# EAGLE design usbSimRadio_v1_0 (EAGLE 5.06)

## Sheet 1 of 2
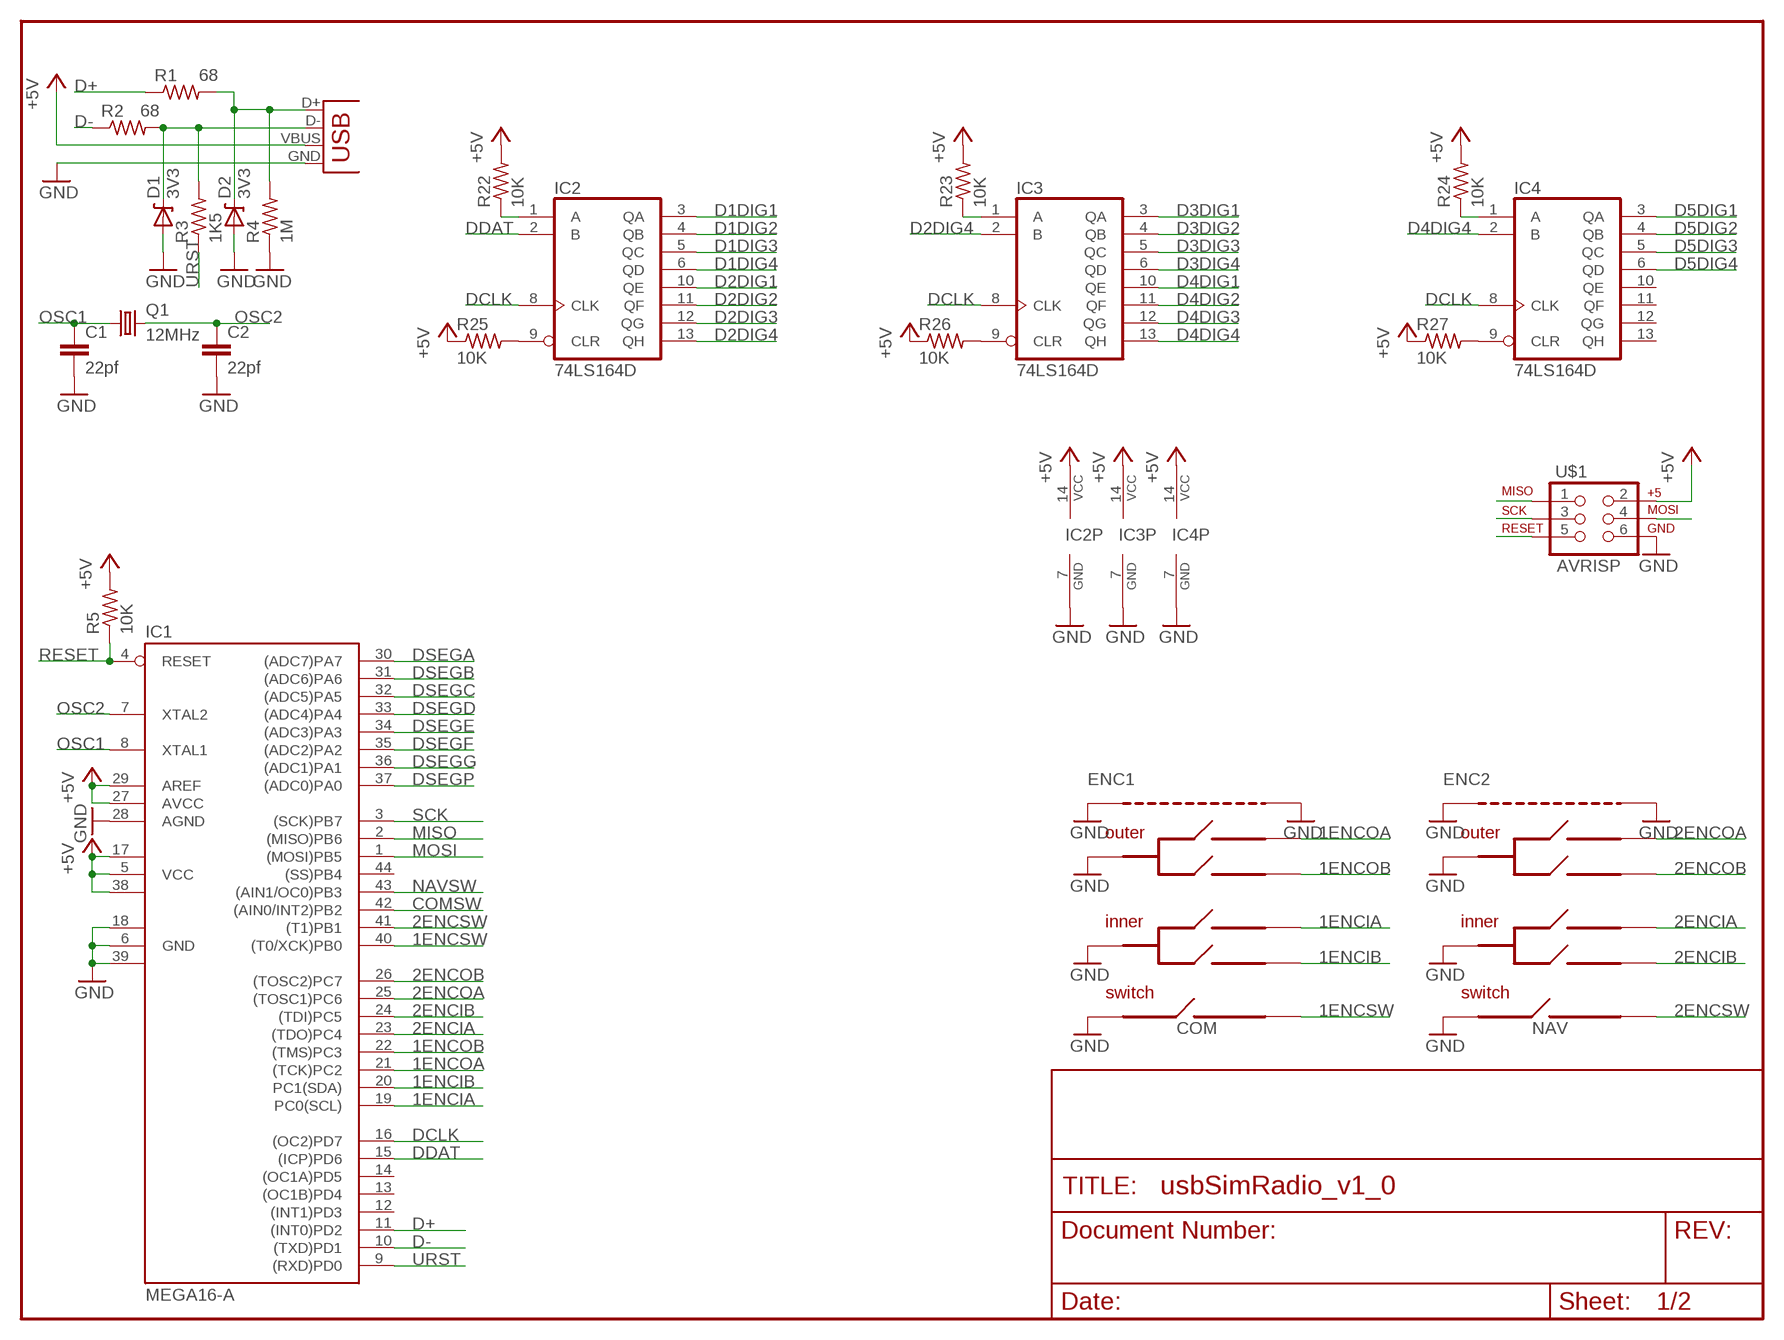
[diagram p0: schematic, sheet 1]

### Parts
C1  22pf  C2.5/2  [C2.5-2]
C2  22pf  C2.5/2  [C2.5-2]
D1  3V3  DIODE-ZENERPTH  [DIODE-ZENER]
D2  3V3  DIODE-ZENERPTH  [DIODE-ZENER]
ENC1  COM  EC11EBB24C03  [EC11EBB24C03]
ENC2  NAV  EC11EBB24C03  [EC11EBB24C03]
IC1  MEGA16-A  [TQFP44]
IC2  74LS164D  [SO14]
IC3  74LS164D  [SO14]
IC4  74LS164D  [SO14]
Q1  12MHz  CRYSTALHC49UP  [HC49UP]
R1  68  R-US_0204/7  [0204/7]
R2  68  R-US_0204/7  [0204/7]
R3  1K5  R-US_0204/7  [0204/7]
R4  1M  R-US_0204/7  [0204/7]
R5  10K  R-US_0204/7  [0204/7]
R22  10K  R-US_0204/7  [0204/7]
R23  10K  R-US_0204/7  [0204/7]
R24  10K  R-US_0204/7  [0204/7]
R25  10K  R-US_0204/7  [0204/7]
R26  10K  R-US_0204/7  [0204/7]
R27  10K  R-US_0204/7  [0204/7]
U$1  AVRISP  AVR_SPI_PRG_6PTH  [2X3]
X1  USBPTH-VERTICAL  [USB-B-PTH-VERTICAL]

### Nets
1ENCIA: ENC1.A IC1.19(PC0(SCL))
1ENCIB: ENC1.B IC1.20(PC1(SDA))
1ENCOA: ENC1.A' IC1.21((TCK)PC2)
1ENCOB: ENC1.B' IC1.22((TMS)PC3)
1ENCSW: ENC1.D IC1.40((T0/XCK)PB0)
2ENCIA: ENC2.A IC1.23((TDO)PC4)
2ENCIB: ENC2.B IC1.24((TDI)PC5)
2ENCOA: ENC2.A' IC1.25((TOSC1)PC6)
2ENCOB: ENC2.B' IC1.26((TOSC2)PC7)
2ENCSW: ENC2.D IC1.41((T1)PB1)
+5V: IC1.5(VCC) IC1.17(VCC1) IC1.27(AVCC) IC1.29(AREF) IC1.38(VCC2) IC2.14(VCC) IC3.14(VCC) IC4.14(VCC) R5.2 R22.2 R23.2 R24.2 R25.1 R26.1 R27.1 U$1.2 X1.VBUS
COMSW: IC1.42((AIN0/INT2)PB2) ; also sheet 2
D1DIG1: IC2.3(QA) ; also sheet 2
D1DIG2: IC2.4(QB) ; also sheet 2
D1DIG3: IC2.5(QC) ; also sheet 2
D1DIG4: IC2.6(QD) ; also sheet 2
D2DIG1: IC2.10(QE) ; also sheet 2
D2DIG2: IC2.11(QF) ; also sheet 2
D2DIG3: IC2.12(QG) ; also sheet 2
D2DIG4: IC2.13(QH) IC3.2(B) ; also sheet 2
D3DIG1: IC3.3(QA) ; also sheet 2
D3DIG2: IC3.4(QB) ; also sheet 2
D3DIG3: IC3.5(QC) ; also sheet 2
D3DIG4: IC3.6(QD) ; also sheet 2
D4DIG1: IC3.10(QE) ; also sheet 2
D4DIG2: IC3.11(QF) ; also sheet 2
D4DIG3: IC3.12(QG) ; also sheet 2
D4DIG4: IC3.13(QH) IC4.2(B) ; also sheet 2
D5DIG1: IC4.3(QA) ; also sheet 2
D5DIG2: IC4.4(QB) ; also sheet 2
D5DIG3: IC4.5(QC) ; also sheet 2
D5DIG4: IC4.6(QD) ; also sheet 2
D+: IC1.11((INT0)PD2) R1.1
D-: IC1.10((TXD)PD1) R2.1
DCLK: IC1.16((OC2)PD7) IC2.8(CLK) IC3.8(CLK) IC4.8(CLK)
DDAT: IC1.15((ICP)PD6) IC2.2(B)
DSEGA: IC1.30((ADC7)PA7) ; also sheet 2
DSEGB: IC1.31((ADC6)PA6) ; also sheet 2
DSEGC: IC1.32((ADC5)PA5) ; also sheet 2
DSEGD: IC1.33((ADC4)PA4) ; also sheet 2
DSEGE: IC1.34((ADC3)PA3) ; also sheet 2
DSEGF: IC1.35((ADC2)PA2) ; also sheet 2
DSEGG: IC1.36((ADC1)PA1) ; also sheet 2
DSEGP: IC1.37((ADC0)PA0) ; also sheet 2
GND: C1.2 C2.2 D1.P$2(A) D2.P$2(A) ENC1.B1 ENC1.B2 ENC1.C ENC1.C' ENC1.E ENC2.B1 ENC2.B2 ENC2.C ENC2.C' ENC2.E IC1.6(GND) IC1.18(GND1) IC1.28(AGND) IC1.39(GND2) IC2.7(GND) IC3.7(GND) IC4.7(GND) R4.1 U$1.6 X1.GND ; also sheet 2
MISO: IC1.2((MISO)PB6) U$1.1
MOSI: IC1.1((MOSI)PB5) U$1.4
N$14: IC2.1(A) R22.1
N$15: IC4.1(A) R24.1
N$19: IC3.1(A) R23.1
N$22: IC2.9(CLR) R25.2
N$23: IC3.9(CLR) R26.2
N$24: IC4.9(CLR) R27.2
N$81: D2.P$1(C) R1.2 R4.2 X1.D+
N$84: D1.P$1(C) R2.2 R3.2 X1.D-
NAVSW: IC1.43((AIN1/OC0)PB3) ; also sheet 2
OSC1: C1.1 IC1.8(XTAL1) Q1.1
OSC2: C2.1 IC1.7(XTAL2) Q1.2
RESET: IC1.4(RESET) R5.1 U$1.5
SCK: IC1.3((SCK)PB7) U$1.3
URST: IC1.9((RXD)PD0) R3.1
Unconnected: IC1.12((INT1)PD3) IC1.13((OC1B)PD4) IC1.14((OC1A)PD5) IC1.44((SS)PB4) IC4.10(QE) IC4.11(QF) IC4.12(QG) IC4.13(QH)

## Sheet 2 of 2
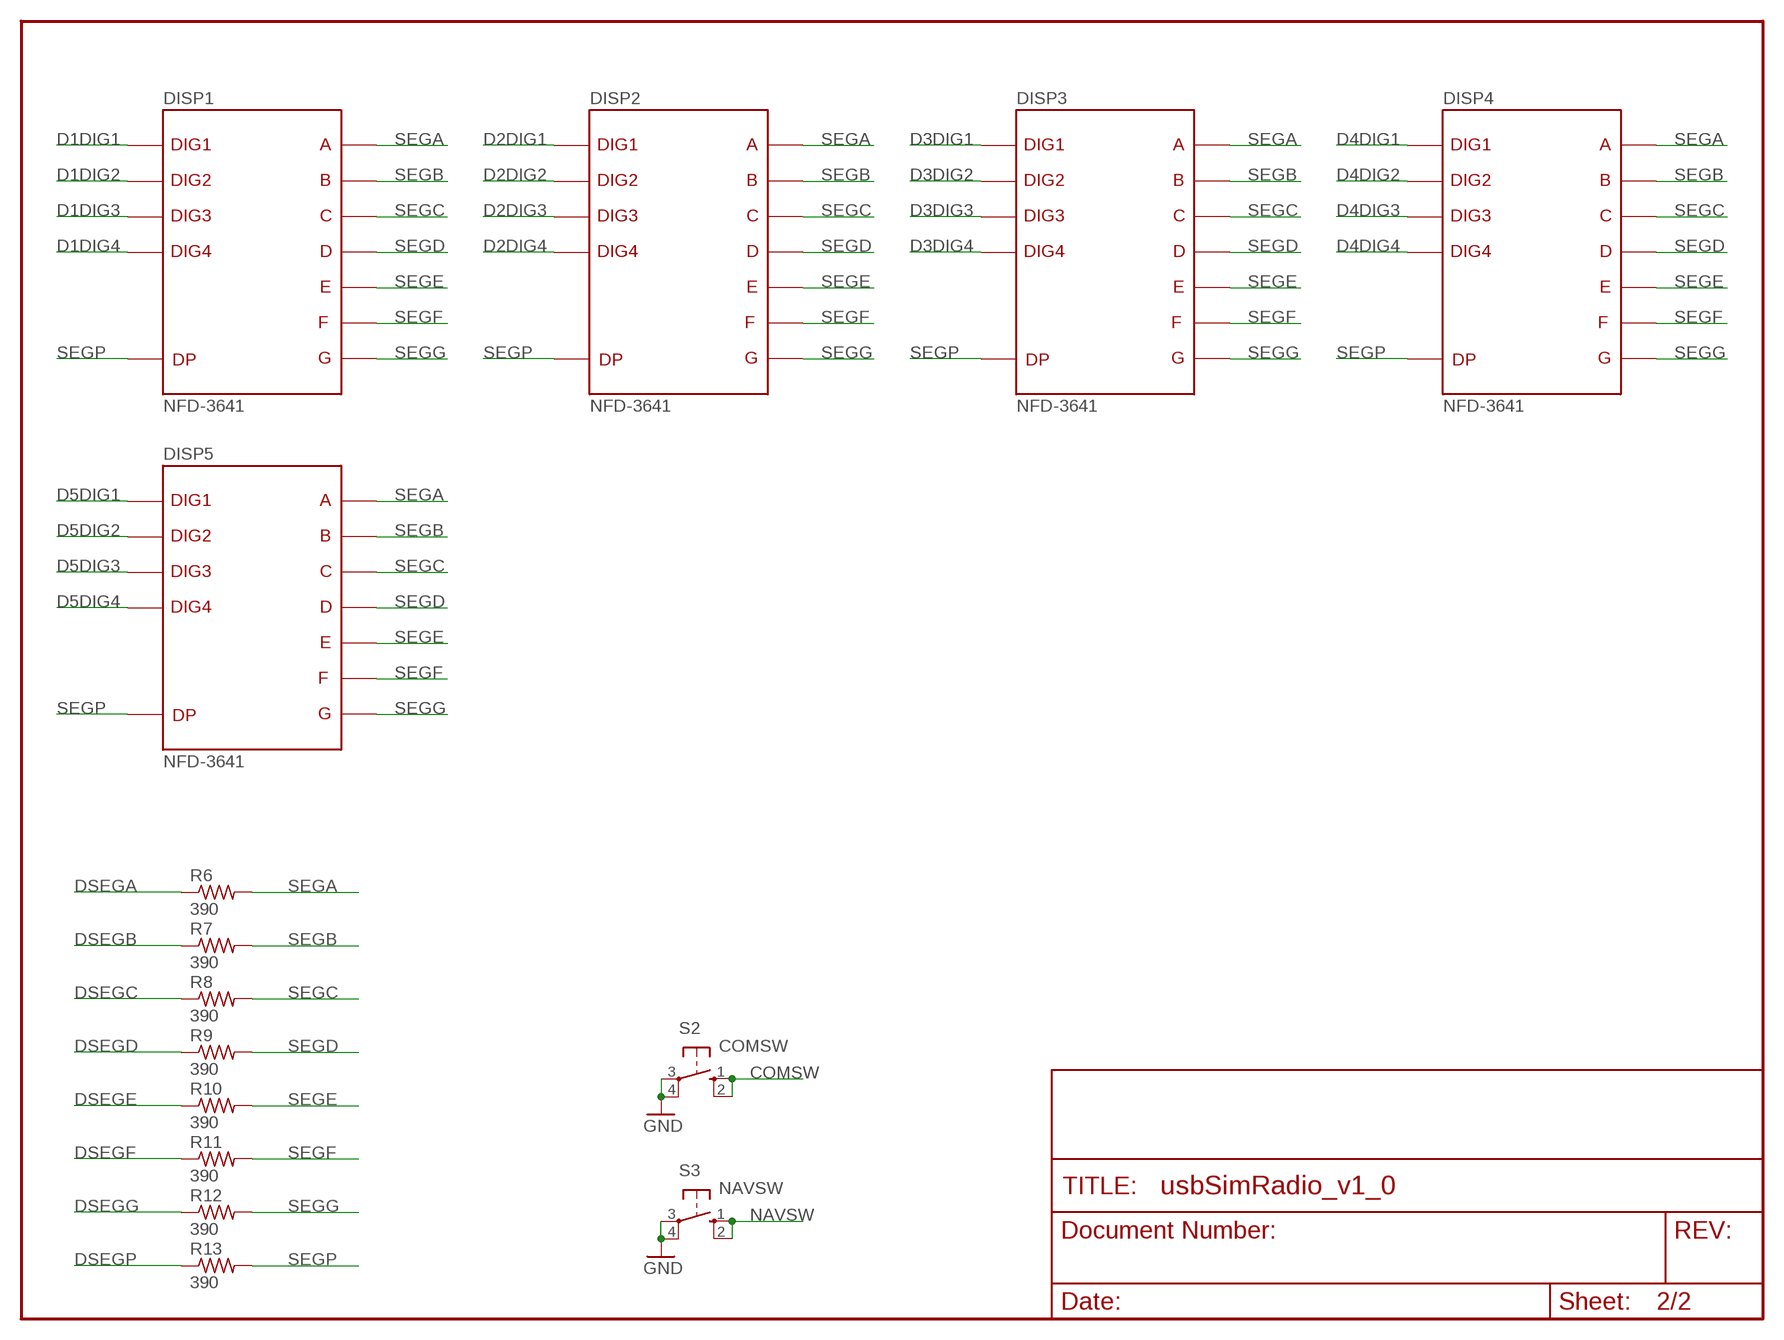
[diagram p1: schematic, sheet 2]

### Parts
DISP1  NFD-3641  [DIL12_0.4]
DISP2  NFD-3641  [DIL12_0.4]
DISP3  NFD-3641  [DIL12_0.4]
DISP4  NFD-3641  [DIL12_0.4]
DISP5  NFD-3641  [DIL12_0.4]
R6  390  R-US_0204/7  [0204/7]
R7  390  R-US_0204/7  [0204/7]
R8  390  R-US_0204/7  [0204/7]
R9  390  R-US_0204/7  [0204/7]
R10  390  R-US_0204/7  [0204/7]
R11  390  R-US_0204/7  [0204/7]
R12  390  R-US_0204/7  [0204/7]
R13  390  R-US_0204/7  [0204/7]
S2  COMSW  10-XX  [B3F-10XX]
S3  NAVSW  10-XX  [B3F-10XX]

### Nets
COMSW: S2.1(S) S2.2(S1) ; also sheet 1
D1DIG1: DISP1.12 ; also sheet 1
D1DIG2: DISP1.9 ; also sheet 1
D1DIG3: DISP1.8 ; also sheet 1
D1DIG4: DISP1.6 ; also sheet 1
D2DIG1: DISP2.12 ; also sheet 1
D2DIG2: DISP2.9 ; also sheet 1
D2DIG3: DISP2.8 ; also sheet 1
D2DIG4: DISP2.6 ; also sheet 1
D3DIG1: DISP3.12 ; also sheet 1
D3DIG2: DISP3.9 ; also sheet 1
D3DIG3: DISP3.8 ; also sheet 1
D3DIG4: DISP3.6 ; also sheet 1
D4DIG1: DISP4.12 ; also sheet 1
D4DIG2: DISP4.9 ; also sheet 1
D4DIG3: DISP4.8 ; also sheet 1
D4DIG4: DISP4.6 ; also sheet 1
D5DIG1: DISP5.12 ; also sheet 1
D5DIG2: DISP5.9 ; also sheet 1
D5DIG3: DISP5.8 ; also sheet 1
D5DIG4: DISP5.6 ; also sheet 1
DSEGA: R6.1 ; also sheet 1
DSEGB: R7.1 ; also sheet 1
DSEGC: R8.1 ; also sheet 1
DSEGD: R9.1 ; also sheet 1
DSEGE: R10.1 ; also sheet 1
DSEGF: R11.1 ; also sheet 1
DSEGG: R12.1 ; also sheet 1
DSEGP: R13.1 ; also sheet 1
GND: S2.3(P) S2.4(P1) S3.3(P) S3.4(P1) ; also sheet 1
NAVSW: S3.1(S) S3.2(S1) ; also sheet 1
SEGA: DISP1.11 DISP2.11 DISP3.11 DISP4.11 DISP5.11 R6.2
SEGB: DISP1.7 DISP2.7 DISP3.7 DISP4.7 DISP5.7 R7.2
SEGC: DISP1.4 DISP2.4 DISP3.4 DISP4.4 DISP5.4 R8.2
SEGD: DISP1.2 DISP2.2 DISP3.2 DISP4.2 DISP5.2 R9.2
SEGE: DISP1.1 DISP2.1 DISP3.1 DISP4.1 DISP5.1 R10.2
SEGF: DISP1.10 DISP2.10 DISP3.10 DISP4.10 DISP5.10 R11.2
SEGG: DISP1.5 DISP2.5 DISP3.5 DISP4.5 DISP5.5 R12.2
SEGP: DISP1.3 DISP2.3 DISP3.3 DISP4.3 DISP5.3 R13.2

## Library data of the parts
C1 C2 = capacitor-wima:C: CAPACITOR naming: grid - package width
D1 D2 = SparkFun:DIODE-ZENER: Zener Diode Production Part - 8199 3.4V Zener Voltage
DISP1-DISP5 = NFD-3641:NFD-3641
ENC1 ENC2 = alps:EC11EBB24C03
IC1 = avr-6:MEGA16: MICROCONTROLLER 16 Kbytes FLASH 1 kbytes SRAM 512 bytes EEPROM USART 8-channel 10 bit ADC
IC2-IC4 = 74xx-us:74*164: 8-bit parallel out SHIFT REGISTER
Q1 = crystal:CRYSTAL: CRYSTAL
R1-R13 R22-R27 = resistor:R-US_: RESISTOR, American symbol
S2 S3 = switch-omron:10-XX: OMRON SWITCH
U$1 = SparkFun:AVR_SPI_PRG_6: AVR ISP 6 Pin This is the reduced ISP connector for AVR programming. Common on Arduino. This footprint will take up less PCB space and can be used with a 10-pin to 6-pin adapter such as SKU: BOB-08508
X1 = SparkFun:USB: USB Connectors USB-B-PTH is fully proven SKU : PRT-00139 USB-miniB is fully proven SKU : PRT-00587 USB-A-PCB is untested. USB-A-H is throughly reviewed, but untested. Spark Fun Electronics SKU : PRT-00437 USB-B-SMT is throughly reviewed, but untested. Needs silkscreen touching up. USB-A-S has not been used/tested USB-MB-H has not been used/tested

## Board
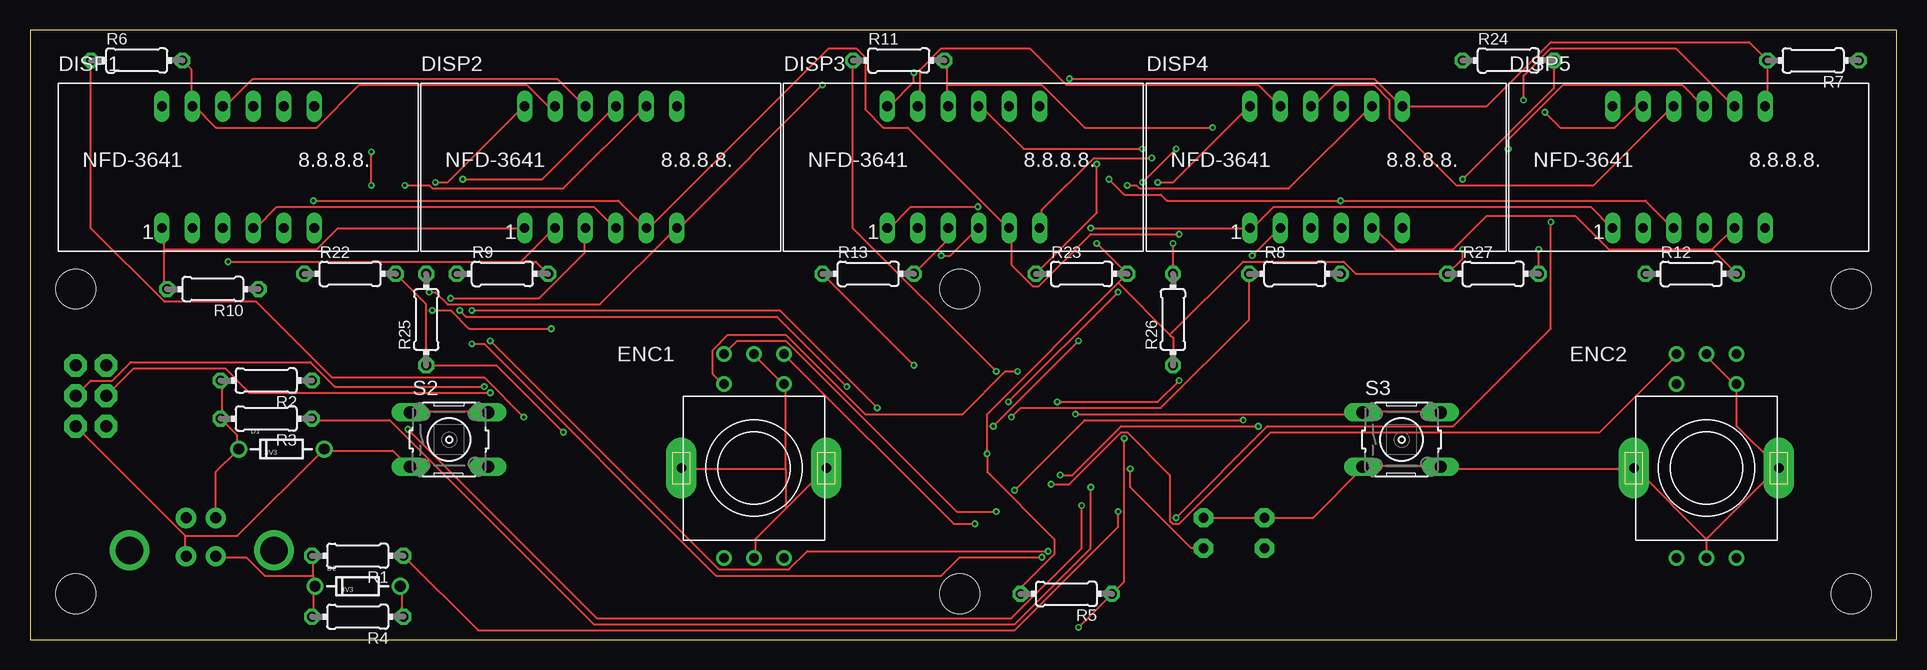
[diagram p2: board, top side]
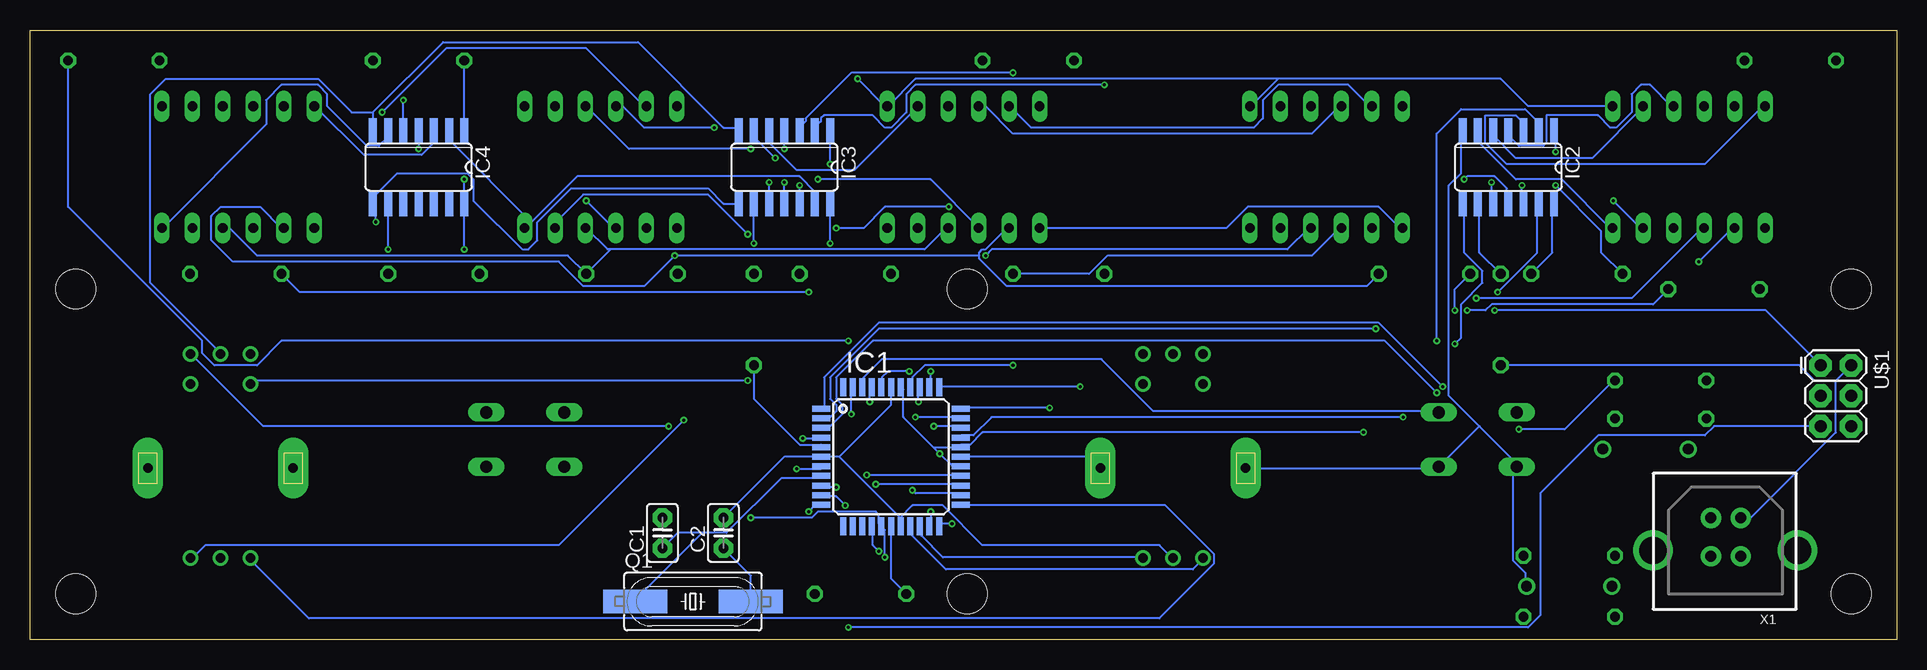
[diagram p3: board, bottom side, seen from below]

Size 155.57 x 50.8 mm. Coordinates in mm from the lower left corner, seen from the top.
Outline: 0,0 155.57,0 155.57,50.8 0,50.8 0,0
Copper layers (1*16): Top 0.035mm / dielectric 1.5mm / Bottom 0.035mm
Design rules "PropagandaPCB": minimum track width 6mil, minimum drill 10mil, track to track 6mil, track to pad 6mil, pad to pad 6mil, via to via 6mil, smd to smd 6mil, copper to edge 10mil, drill to drill 10mil, minimum pad ring 10mil, minimum via ring 6mil, stop-mask expansion 2mil, vias tented up to drill 100mil, thermal gap 10mil

### Footprints (pad centres in the part's own frame; a part is rotated, then mirrored left to right if it is on the bottom)
C2.5-2 = drill 0.813 pad 1.6 octagon: 1 -1.27,0; 2 1.27,0
DIODE-ZENER = drill 0.9 round: P$1 -3.556,0; P$2 3.556,0
DIL12_0.4 = drill 0.8 long: 1 -6.35,-5.08; 2 -3.81,-5.08; 3 -1.27,-5.08; 4 1.27,-5.08; 5 3.81,-5.08; 6 6.35,-5.08; 7 6.35,5.08; 8 3.81,5.08; 9 1.27,5.08; 10 -1.27,5.08; 11 -3.81,5.08; 12 -6.35,5.08
EC11EBB24C03 = drill 0.8 round: A -2.5,-7.5; A' -2.5,9.5; B 2.5,-7.5; B' 2.5,9.5; C 0,-7.5; C' 0,9.5; D -2.5,7; E 2.5,7 | drill 0.8 pad 2.54 long: B1 -6.048,0; B2 6.048,0
TQFP44 = smd 1.5 x 0.5: 1 -5.8,4; 2 -5.8,3.2; 3 -5.8,2.4; 4 -5.8,1.6; 5 -5.8,0.8; 6 -5.8,0; 7 -5.8,-0.8; 8 -5.8,-1.6; 9 -5.8,-2.4; 10 -5.8,-3.2; 11 -5.8,-4; 23 5.8,-4; 24 5.8,-3.2; 25 5.8,-2.4; 26 5.8,-1.6; 27 5.8,-0.8; 28 5.8,0; 29 5.8,0.8; 30 5.8,1.6; 31 5.8,2.4; 32 5.8,3.2; 33 5.8,4 | smd 0.5 x 1.5: 12 -4,-5.8; 13 -3.2,-5.8; 14 -2.4,-5.8; 15 -1.6,-5.8; 16 -0.8,-5.8; 17 0,-5.8; 18 0.8,-5.8; 19 1.6,-5.8; 20 2.4,-5.8; 21 3.2,-5.8; 22 4,-5.8; 34 4,5.8; 35 3.2,5.8; 36 2.4,5.8; 37 1.6,5.8; 38 0.8,5.8; 39 0,5.8; 40 -0.8,5.8; 41 -1.6,5.8; 42 -2.4,5.8; 43 -3.2,5.8; 44 -4,5.8
SO14 = smd 0.66 x 2.032: 1 -3.81,-3.073; 2 -2.54,-3.073; 3 -1.27,-3.073; 4 0,-3.073; 5 1.27,-3.073; 6 2.54,-3.073; 7 3.81,-3.073; 8 3.81,3.073; 9 2.54,3.073; 10 1.27,3.073; 11 0,3.073; 12 -1.27,3.073; 13 -2.54,3.073; 14 -3.81,3.073
HC49UP = smd 5.334 x 1.93: 1 -4.826,0; 2 4.826,0
0204/7 = drill 0.813 octagon: 1 -3.81,0; 2 3.81,0
B3F-10XX = drill 1.016 long: 1 -3.251,2.261; 2 3.251,2.261; 3 -3.251,-2.261; 4 3.251,-2.261
2X3 = drill 1.016 pad 1.88 octagon: 1 0,0; 2 0,2.54; 3 2.54,0; 4 2.54,2.54; 5 5.08,0; 6 5.08,2.54
STAND-OFF = hole 3.302: 0,0
USB-B-PTH-VERTICAL = drill 0.914 pad 1.676 round: D+ 4.826,4.394; D- 4.826,7.595; GND 7.315,4.394; VBUS 7.315,7.595 | drill 2.286 round: P$1 0,4.902; P$2 12.04,4.902

### Placement (x,y rotation side)
C1  102.87,8.89 90 bottom
C2  97.79,8.89 90 bottom
D1  20.95,15.88 0 top
D2  27.3,4.45 0 top
DISP1  17.34,39.37 0 top
DISP2  47.56,39.37 0 top
DISP3  77.79,39.37 0 top
DISP4  108.01,39.37 0 top
DISP5  138.24,39.37 0 top
ENC1  60.33,14.29 0 top
ENC2  139.7,14.29 0 top
IC1  83.82,15.24 0 bottom
IC2  32.38,39.37 180 bottom
IC3  92.71,39.37 180 bottom
IC4  123.19,39.37 180 bottom
Q1  100.33,3.17 0 bottom
R1  27.3,6.99 180 top
R2  19.68,21.59 180 top
R3  19.68,18.41 180 top
R4  27.3,1.91 180 top
R5  86.36,3.81 180 top
R6  8.89,48.26 0 top
R7  148.59,48.26 180 top
R8  105.41,30.48 0 top
R9  39.37,30.48 0 top
R10  15.24,29.21 180 top
R11  72.39,48.26 0 top
R12  138.43,30.48 0 top
R13  69.85,30.48 0 top
R22  26.67,30.48 0 top
R23  87.63,30.48 0 top
R24  123.19,48.26 0 top
R25  33.02,26.67 90 top
R26  95.25,26.67 90 top
R27  121.92,30.48 0 top
S2  34.92,16.67 0 top
S3  114.3,16.67 0 top
U$1  6.35,22.86 270 bottom
U$2  [STAND-OFF]  3.81,3.81 0 top
U$3  [STAND-OFF]  3.81,29.21 0 top
U$4  [STAND-OFF]  77.47,29.21 0 top
U$5  [STAND-OFF]  151.76,3.81 0 top
U$6  [STAND-OFF]  151.76,29.21 0 top
U$7  [STAND-OFF]  77.47,3.81 0 top
X1  20.32,2.54 0 bottom

### Tracks (layer width: path | path; a pad name or v marks a point on that pad's centre or on a via)
1ENCIA
  Bottom 0.152: IC1.19 82.04,9.4 82.04,8.64 79.25,5.84 58.67,5.84 57.91,6.6 ENC1.A
1ENCIB
  Bottom 0.152: IC1.20 81.28,9.4 81.28,8.64 79.5,6.86 62.99,6.86 ENC1.B
1ENCOA  (via drill 0.25)
  Top 0.152: v80.52,10.67 77.22,10.67 62.99,24.89 58.93,24.89 57.91,23.88 ENC1.A'
  Bottom 0.152: v80.52,10.67 80.52,9.65 IC1.21
1ENCOB  (via drill 0.25)
  Top 0.152: v78.74,9.65 76.96,9.65 62.99,23.62 ENC1.B'
  Bottom 0.152: v78.74,9.65 79.76,9.65 IC1.22
1ENCSW  (via drill 0.25)
  Top 0.152: v82.3,22.35 81.28,22.35 77.72,18.8 69.6,18.8 62.99,25.4 58.17,25.4 56.9,24.13 56.9,22.1 57.66,21.34 ENC1.D
  Bottom 0.152: v82.3,22.35 84.07,22.35 84.58,21.84 84.58,21.08 IC1.40
2ENCIA
  Bottom 0.152: IC1.23 77.98,11.18 60.96,11.18 56.9,7.11 56.9,6.35 61.47,1.78 132.33,1.78 137.16,6.6 ENC2.A
2ENCIB  (via drill 0.25)
  Top 0.152: v82.04,12.45 87.88,18.29 v101.09,18.29
  Bottom 0.152: v82.04,12.45 81.79,12.19 78.23,12.19 IC1.24 | v101.09,18.29 111.51,7.87 140.97,7.87 141.99,6.86 ENC2.B
2ENCOA  (via drill 0.25)
  Top 0.152: v85.09,12.95 86.61,12.95 90.93,17.27 91.44,17.27 95,13.72 95,9.91 95.25,9.65 95.76,9.65 103.38,17.27 130.81,17.27 137.16,23.62 ENC2.A'
  Bottom 0.152: v85.09,12.95 78.23,12.95 IC1.25
2ENCOB  (via drill 0.25)
  Top 0.152: v85.85,13.72 86.87,13.72 90.93,17.78 v102.36,17.78
  Bottom 0.152: v85.85,13.72 78.23,13.72 IC1.26 | v102.36,17.78 136.14,17.78 141.99,23.62 ENC2.B'
2ENCSW  (via drill 0.25)
  Top 0.152: v85.6,19.81 93.98,19.81 v95.76,21.59
  Bottom 0.152: v85.6,19.81 85.6,20.83 IC1.41 | v95.76,21.59 136.91,21.59 137.16,21.34 ENC2.D
+5V  (via drill 0.25)
  Top 0.152: R22.2 33.02,27.94 R25.1 38.86,22.86 v44.45,17.27 | v119.38,32.51 119.38,31.75 R27.1 110.49,30.48 109.47,31.5 101.09,31.5 95,25.4 | R24.2 127,45.97 v119.38,38.35 | v88.9,33.02 R23.2 90.68,29.72 | R5.2 82.55,4.32 85.34,7.11 85.34,8.38 79.76,13.97 v79.76,15.49 79.76,18.8 90.68,29.72 | R26.1 95.25,25.15 95,25.4 | 90.68,29.72 95,25.4
  Bottom 0.152: R22.2 28.7,32.26 28.7,36.07 IC2.14 | 5.08,21.59 5.08,17.27 12.19,10.16 12.95,10.16 X1.VBUS | 5.08,21.59 U$1.2 | R25.1 8.13,22.86 6.86,21.59 5.08,21.59 | v119.38,32.51 119.38,36.07 IC4.14 119.38,36.32 v119.38,38.35 | R26.1 95.25,20.07 91.44,16.26 89.66,16.26 IC1.5 | 80.26,16 82.8,18.54 82.8,20.83 IC1.38 | 80.26,16 v79.76,15.49 78.74,14.48 78.23,14.48 IC1.27 | 80.26,16 78.23,16 IC1.29 77.98,16.26 77.22,16.26 76.2,17.27 v44.45,17.27 | R5.2 83.82,5.08 83.82,9.4 IC1.17 | v88.9,33.02 88.9,36.07 IC3.14
COMSW
  Top 0.152: S2.1 31.75,19.05 38.1,19.05 S2.2
  Bottom 0.152: IC1.42 86.11,21.08 86.11,21.84 84.58,23.37 66.29,23.37 61.98,19.05 38.35,19.05 S2.2
D1DIG1
  Bottom 0.152: IC2.3 31.24,42.67 31.24,43.18 31.75,43.69 34.29,43.69 34.29,41.4 32.51,39.62 16,39.62 11.18,44.45 DISP1.12
D1DIG2
  Bottom 0.152: IC2.4 32.26,42.42 32.26,41.91 31.5,41.15 29.46,41.15 29.21,41.4 29.21,43.69 24.89,43.69 23.88,42.67 23.37,42.67 22.1,43.94 22.1,45.47 21.34,46.23 20.57,46.23 18.8,44.45 DISP1.9
D1DIG3
  Bottom 0.152: IC2.5 33.53,42.42 33.53,41.91 31.75,40.13 25.4,40.13 21.08,44.45 DISP1.8
D1DIG4
  Bottom 0.152: IC2.6 34.8,42.42 34.8,41.4 31.75,38.35 27.94,38.35 23.88,34.29 DISP1.6
D2DIG1  (via drill 0.25)
  Top 0.152: v33.78,38.1 34.8,38.1 41.15,44.45 DISP2.12
  Bottom 0.152: v33.78,38.1 33.78,36.32 IC2.10
D2DIG2  (via drill 0.25)
  Top 0.152: v36.07,38.35 42.67,38.35 48.77,44.45 DISP2.9
  Bottom 0.152: v36.07,38.35 35.81,38.61 33.53,38.61 32.51,37.59 32.51,36.32 IC2.11
D2DIG3  (via drill 0.25)
  Top 0.152: v31.24,37.85 33.27,37.85 33.53,37.59 44.45,37.59 51.31,44.45 DISP2.8
  Bottom 0.152: v31.24,37.85 31.24,36.32 IC2.12
D2DIG4  (via drill 0.25)
  Top 0.152: v33.27,28.96 33.78,28.96 34.8,27.94 47.5,27.94 53.85,34.29 DISP2.6 54.1,34.29 v66.04,46.23
  Bottom 0.152: v33.27,28.96 29.97,32.26 29.97,36.07 IC2.13 | v66.04,46.23 81.79,46.23 82.55,45.47 82.55,43.94 83.82,42.67 84.33,42.67 85.34,43.69 89.41,43.69 89.66,43.43 89.66,43.18 90.17,42.67 IC3.2
D3DIG1  (via drill 0.25)
  Top 0.152: v73.66,47.24 73.66,46.48 71.63,44.45 DISP3.12
  Bottom 0.152: v73.66,47.24 87.12,47.24 90.93,43.43 90.93,43.18 91.44,42.67 IC3.3
D3DIG2  (via drill 0.25)
  Top 0.152: v92.71,40.89 82.8,40.89 79.25,44.45 DISP3.9
  Bottom 0.152: v92.71,40.89 92.71,42.42 IC3.4
D3DIG3
  Bottom 0.152: IC3.5 93.98,42.42 93.98,41.4 91.69,39.12 86.87,39.12 81.53,44.45 DISP3.8
D3DIG4  (via drill 0.25)
  Top 0.152: v93.47,40.13 88.65,40.13 84.33,35.81 84.33,34.29 DISP3.6
  Bottom 0.152: v93.47,40.13 95.25,41.91 95.25,42.42 IC3.6
D4DIG1  (via drill 0.25)
  Top 0.152: v93.98,38.1 95.25,38.1 101.6,44.45 DISP4.12
  Bottom 0.152: v93.98,38.1 93.98,36.32 IC3.10
D4DIG2  (via drill 0.25)
  Top 0.152: v92.71,38.1 v95.5,40.89
  Bottom 0.152: v92.71,38.1 92.71,36.32 IC3.11 | v95.5,40.89 105.66,40.89 109.22,44.45 DISP4.9
D4DIG3  (via drill 0.25)
  Top 0.152: v91.44,37.85 92.2,37.85 92.46,37.59 104.9,37.59 111.76,44.45 DISP4.8
  Bottom 0.152: v91.44,37.85 91.44,36.32 IC3.12
D4DIG4
  Bottom 0.152: 113.79,34.8 114.3,34.29 DISP4.6 113.79,34.8 | 113.79,34.8 109.98,38.61 91.44,38.61 90.17,37.34 90.17,36.32 IC3.13 | 113.79,34.8 120.65,41.66 120.65,42.42 IC4.2
D5DIG1
  Bottom 0.152: IC4.3 121.92,42.42 121.92,41.4 122.94,40.39 127.76,40.39 131.83,44.45 DISP5.12
D5DIG2  (via drill 0.25)
  Top 0.152: v123.19,40.89 123.19,41.66 127.76,46.23 137.67,46.23 139.45,44.45 DISP5.9
  Bottom 0.152: v123.19,40.89 123.19,42.42 IC4.4
D5DIG3  (via drill 0.25)
  Top 0.152: v124.46,44.96 124.46,46.99 126.75,49.28 137.16,49.28 141.99,44.45 DISP5.8
  Bottom 0.152: v124.46,44.96 124.46,42.67 IC4.5
D5DIG4
  Bottom 0.152: IC4.6 125.73,42.42 125.73,41.91 126.49,41.15 127.51,41.15 130.81,44.45 130.81,45.47 131.57,46.23 134.62,46.23 135.89,44.96 135.89,42.93 144.53,34.29 DISP5.6
D+  (via drill 0.25)
  Top 0.152: v90.68,10.67 90.68,9.4 82.04,0.76 37.34,0.76 31.24,6.86 R1.1
  Bottom 0.152: v90.68,10.67 90.17,11.18 89.66,11.18 IC1.11
D-  (via drill 0.25)
  Top 0.152: v87.63,11.18 87.63,7.62 81.79,1.78 47.24,1.78 v31.5,17.53
  Bottom 0.152: v87.63,11.18 88.39,11.94 89.41,11.94 IC1.10 | v31.5,17.53 27.69,17.53 23.62,21.59 R2.1
DCLK  (via drill 0.25)
  Top 0.152: v95.5,10.16 103.12,17.78 118.62,17.78 126.75,25.91 v126.75,34.8 | v36.83,24.64 37.85,24.64 57.15,5.33 75.95,5.33 77.47,6.86 v84.33,6.86
  Bottom 0.152: v95.5,10.16 90.42,10.16 89.92,10.67 85.09,10.67 84.84,10.41 84.84,9.65 IC1.16 84.58,9.4 84.33,9.14 v84.33,6.86 | v126.75,34.8 126.75,35.81 127,36.07 IC4.8 127,36.32 127,36.83 124.97,38.86 119.13,38.86 118.62,38.35 118.62,36.58 114.55,32.51 114.05,32.51 113.28,33.27 113.28,34.8 110.49,37.59 99.06,37.59 97.79,36.32 96.52,36.32 IC3.8 | v36.83,24.64 36.32,25.15 36.32,27.94 34.54,29.72 34.54,30.73 36.07,32.26 36.07,36.07 IC2.8
DDAT  (via drill 0.25)
  Top 0.152: v84.84,7.37 64.77,7.37 63.25,5.84 57.4,5.84 v38.35,24.89
  Bottom 0.152: v84.84,7.37 85.34,7.87 85.34,9.4 IC1.15 | v38.35,24.89 38.35,42.16 36.32,44.2 30.99,44.2 29.97,43.18 29.97,42.67 IC2.2
DSEGA  (via drill 0.25)
  Top 0.152: v41.15,18.54 37.85,21.84 25.15,21.84 18.8,28.19 11.18,28.19 5.08,34.29 R6.1
  Bottom 0.152: v41.15,18.54 75.44,18.54 76.96,17.02 77.98,17.02 IC1.30
DSEGB  (via drill 0.25)
  Top 0.152: v80.26,17.78 v87.38,24.89
  Bottom 0.152: v80.26,17.78 78.23,17.78 IC1.31 | v87.38,24.89 134.62,24.89 136.65,22.86 140.21,22.86 141.22,23.88 141.22,24.89 152.4,36.07 R7.1
DSEGC  (via drill 0.25)
  Top 0.152: v81.79,18.54 82.55,19.3 94.23,19.3 101.6,26.67 R8.1
  Bottom 0.152: v81.79,18.54 78.23,18.54 IC1.32
DSEGD  (via drill 0.25)
  Top 0.152: v70.61,19.3 62.48,27.43 v36.83,27.43
  Bottom 0.152: v70.61,19.3 77.98,19.3 IC1.33 | v36.83,27.43 36.83,29.21 R9.1
DSEGE  (via drill 0.25)
  Top 0.152: v68.07,21.08 62.23,26.92 36.32,26.92 v35.81,27.43
  Bottom 0.152: v68.07,21.08 79.76,21.08 IC1.34 | v35.81,27.43 34.29,27.43 33.78,27.94 20.32,27.94 R10.1
DSEGF  (via drill 0.25)
  Top 0.152: v80.52,22.35 68.58,34.29 R11.1
  Bottom 0.152: v80.52,22.35 80.52,21.08 IC1.35
DSEGG  (via drill 0.25)
  Top 0.152: v81.53,19.81 v90.68,28.96
  Bottom 0.152: v81.53,19.81 81.53,20.83 IC1.36 | v90.68,28.96 133.1,28.96 R12.1
DSEGP  (via drill 0.25)
  Top 0.152: R13.1 v73.66,22.86
  Bottom 0.152: v73.66,22.86 81.03,22.86 82.04,21.84 82.04,21.08 IC1.37
GND
  Top 0.152: 139.7,8.38 139.7,6.86 ENC2.C | 139.7,8.38 133.86,14.22 ENC2.B1 133.6,14.22 117.6,14.22 S3.4 117.35,14.48 111.25,14.48 S3.3 111,14.22 106.93,10.16 C1.2 C2.2 | ENC2.C' 139.7,23.62 141.99,21.34 ENC2.E 142.24,21.08 142.24,17.78 145.54,14.48 ENC2.B2 145.54,14.22 139.7,8.38 | ENC1.C' 60.45,23.62 62.74,21.34 ENC1.E 62.99,21.08 62.99,14.22 | 62.99,10.92 66.29,14.22 ENC1.B2 | 62.99,10.92 60.45,8.38 60.45,6.86 ENC1.C | 62.99,14.22 62.99,10.92 | 62.99,14.22 54.36,14.22 ENC1.B1 | 12.95,8.64 12.95,7.11 X1.GND | 12.95,8.64 U$1.6 | R4.1 30.99,2.03 30.99,4.32 D2.P$2 | S2.3 31.5,14.48 30.23,15.75 24.64,15.75 D1.P$2 24.38,15.75 17.27,8.64 12.95,8.64
  Bottom 0.152: 127,43.94 121.16,49.78 104.9,49.78 97.79,42.67 96.52,42.67 IC3.7 | 127,43.94 127,42.67 IC4.7 | 83.06,10.16 83.06,9.65 IC1.18 83.06,10.16 | 83.06,10.16 88.14,15.24 | 88.14,15.24 89.41,15.24 IC1.6 89.66,15.24 92.71,15.24 C2.2 | 88.14,15.24 83.82,19.56 83.82,20.83 IC1.39 | 127,43.94 128.78,43.94 131.57,46.74 144.27,46.74 145.54,45.47 145.54,29.72 139.7,23.88 ENC2.C' | IC1.28 77.98,15.24 67.31,15.24 66.55,14.48 ENC1.B2 | 32,14.99 31.5,14.48 S2.3 32,14.99 | 32,14.99 34.8,17.78 | 34.8,17.78 37.34,20.32 37.34,37.85 36.32,38.86 36.32,42.42 IC2.7 | 34.8,17.78 38.1,14.48 S2.4 38.35,14.22 54.1,14.22 ENC1.B1 | 32,14.99 32,6.6 30.99,5.59 30.99,4.57 D2.P$2 | 83.06,10.16 82.04,11.18 79.5,11.18 76.2,7.87 61.47,7.87 60.45,6.86 ENC1.C
MISO  (via drill 0.25)
  Top 0.152: v43.43,25.91 36.58,25.91 35.05,27.43 v33.53,27.43
  Bottom 0.152: v43.43,25.91 84.84,25.91 88.9,21.84 88.9,20.07 88.39,19.56 88.39,19.05 88.9,18.54 89.41,18.54 IC1.2 | v33.53,27.43 10.92,27.43 U$1.1
MOSI  (via drill 0.25)
  Top 0.152: v37.85,21.08 25.4,21.08 23.37,23.11 8.38,23.11 6.86,21.59 5.08,21.59 U$1.4
  Bottom 0.152: v37.85,21.08 43.18,26.42 84.84,26.42 89.41,21.84 89.41,19.3 IC1.1
N$14  (via drill 0.25)
  Top 0.152: v28.45,37.85 v28.45,40.64
  Bottom 0.152: v28.45,40.64 28.45,42.42 IC2.1 | v28.45,37.85 24.64,34.04 24.64,32.26 R22.1
N$15
  Bottom 0.152: R24.1 119.38,42.67 IC4.1
N$19  (via drill 0.25)
  Top 0.152: v88.9,39.62 88.9,35.56 R23.1
  Bottom 0.152: v88.9,39.62 88.9,42.42 IC3.1
N$22
  Bottom 0.152: R25.2 34.8,32.26 34.8,36.07 IC2.9
N$23  (via drill 0.25)
  Top 0.152: R26.2 v95.25,33.02
  Bottom 0.152: v95.25,33.02 95.25,36.07 IC3.9
N$24  (via drill 0.25)
  Top 0.152: R27.2 v125.73,32.51
  Bottom 0.152: v125.73,32.51 125.73,36.07 IC4.9
N$81
  Top 0.152: R4.2 23.62,2.03 23.62,4.32 D2.P$1 23.62,4.57 23.62,5.33 | 23.62,5.33 23.62,6.86 R1.2 | 23.62,5.33 19.56,5.33 18.03,6.86 15.49,6.86 X1.D+
N$84
  Top 0.152: R2.2 16,21.59 16,18.54 R3.2 16,18.29 17.27,17.02 17.27,16 D1.P$1 17.27,15.75 15.49,13.97 15.49,10.16 X1.D-
NAVSW  (via drill 0.25)
  Top 0.152: v87.12,18.8 111,18.8 S3.1 111.25,19.05 117.35,19.05 S3.2
  Bottom 0.152: v87.12,18.8 87.12,20.83 IC1.43
OSC1
  Bottom 0.152: 99.57,8.89 101.6,8.89 C1.1 | 99.57,8.89 97.54,8.89 92.96,13.46 89.66,13.46 IC1.8 | 99.57,8.89 105.16,3.3 Q1.1
OSC2  (via drill 0.25)
  Top 0.152: v91.69,14.22 91.69,12.7 96.77,7.62 C2.1
  Bottom 0.152: v91.69,14.22 89.66,14.22 IC1.7 | C2.1 95.5,5.33 95.5,3.3 Q1.2
RESET  (via drill 0.25)
  Top 0.152: v91.19,16.76 91.19,4.83 R5.1 v87.38,1.02
  Bottom 0.152: v91.19,16.76 89.66,16.76 IC1.4 | U$1.5 15.24,17.78 16,17.02 24.89,17.02 29.72,12.19 29.72,2.03 30.73,1.02 v87.38,1.02
SCK  (via drill 0.25)
  Top 0.152: v38.35,20.57 18.29,20.57 16.26,22.61 8.64,22.61 U$1.3
  Bottom 0.152: v38.35,20.57 42.67,24.89 85.34,24.89 88.39,21.84 88.39,20.07 87.88,19.56 87.88,18.8 88.9,17.78 89.41,17.78 IC1.3
SEGA  (via drill 0.25)
  Top 0.152: R6.2 13.46,47.5 13.46,44.45 DISP1.11 13.72,44.45 15.49,42.67 23.88,42.67 27.43,46.23 41.4,46.23 43.18,44.45 43.69,44.45 DISP2.11 | DISP3.11 74.17,44.45 74.17,47.5 75.95,49.28 83.31,49.28 86.36,46.23 102.36,46.23 104.14,44.45 DISP4.11 | v126.24,43.94 127.51,42.67 132.08,42.67 133.86,44.45 134.37,44.45 DISP5.11
  Bottom 0.152: v126.24,43.94 120.9,49.28 109.22,49.28 104.39,44.45 DISP4.11 | DISP2.11 43.94,44.45 45.72,46.23 51.56,46.23 52.83,44.96 52.83,43.43 53.59,42.67 72.14,42.67 73.91,44.45 DISP3.11
SEGB  (via drill 0.25)
  Top 0.152: DISP5.7 144.78,44.45 R7.2 143.26,49.78 126.75,49.78 121.41,44.45 114.55,44.45 DISP4.7 114.3,44.45 112.01,46.74 v86.61,46.74
  Bottom 0.152: 51.56,46.74 33.02,46.74 30.73,44.45 23.88,44.45 DISP1.7 | 51.56,46.74 53.85,44.45 DISP2.7 | 51.56,46.74 81.79,46.74 84.07,44.45 DISP3.7 84.33,44.45 v86.61,46.74
SEGC  (via drill 0.25)
  Top 0.152: DISP1.4 18.8,34.29 20.57,36.07 46.99,36.07 48.77,34.29 DISP2.4 | v75.95,32 76.71,32 78.99,34.29 DISP3.4
  Bottom 0.152: DISP5.4 139.45,34.29 138.94,34.29 136.65,32 110.74,32 R8.2 107.19,32.51 | 107.19,32.51 107.44,32.51 109.22,34.29 DISP4.4 | 107.19,32.51 81.03,32.51 79.25,34.29 DISP3.4 | v75.95,32 75.44,32.51 50.8,32.51 49.02,34.29 DISP2.4
SEGD  (via drill 0.25)
  Top 0.152: 40.89,31.5 42.16,31.5 R9.2 | v16.51,31.5 40.89,31.5 | 40.89,31.5 43.69,34.29 DISP2.2 | v101.85,32 104.14,34.29 DISP4.2
  Bottom 0.152: v16.51,31.5 13.72,34.29 DISP1.2 | 76.45,32 76.45,31.75 74.17,29.46 44.2,29.46 R9.2 | 76.45,32 76.45,32.26 76.2,32.51 75.95,32.51 74.17,34.29 DISP3.2 | 76.45,32 v101.85,32 104.39,29.46 109.47,29.46 111.51,31.5 138.68,31.5 140.46,33.27 140.46,35.31 139.7,36.07 136.4,36.07 134.62,34.29 DISP5.2
SEGE  (via drill 0.25)
  Top 0.152: DISP5.1 131.83,34.29 130.05,36.07 103.63,36.07 101.85,34.29 DISP4.1 101.6,34.29 v88.39,34.29 | 11.18,32.51 11.18,29.46 R10.2 | 11.18,32.51 11.18,34.29 DISP1.1 | 11.18,32.51 23.88,32.51 25.65,34.29 41.15,34.29 DISP2.1 | v78.99,36.07 73.41,36.07 71.63,34.29 DISP3.1
  Bottom 0.152: DISP3.1 71.37,34.29 55.88,34.29 54.1,36.07 43.18,36.07 41.4,34.29 DISP2.1 | v88.39,34.29 86.11,34.29 84.33,36.07 v78.99,36.07
SEGF  (via drill 0.25)
  Top 0.152: DISP4.10 106.93,44.45 108.71,46.23 112.01,46.23 113.28,44.96 113.28,43.43 118.87,37.85 130.3,37.85 136.91,44.45 DISP5.10 | 76.45,46.23 76.45,48.01 R11.2 | 76.45,46.23 76.45,44.45 DISP3.10 | DISP1.10 16.26,44.45 18.54,46.74 43.94,46.74 46.23,44.45 DISP2.10 | v98.55,42.67 87.88,42.67 84.33,46.23 76.45,46.23
  Bottom 0.152: DISP3.10 76.45,44.45 75.95,44.45 73.66,42.16 48.77,42.16 46.48,44.45 DISP2.10 | v98.55,42.67 104.39,42.67 106.17,44.45 106.68,44.45 DISP4.10
SEGG  (via drill 0.25)
  Top 0.152: 140.21,32.51 131.57,32.51 128.78,35.31 121.41,35.31 118.62,32.51 113.79,32.51 112.01,34.29 DISP4.5 | 140.21,32.51 141.99,34.29 DISP5.5 | 140.21,32.51 R12.2 | v23.62,36.58 49.02,36.58 51.31,34.29 DISP2.5 51.56,34.29 66.55,49.28 68.83,49.28 69.6,48.51 69.6,44.2 71.12,42.67 73.15,42.67 81.53,34.29 DISP3.5 81.79,34.29 81.79,31.24 83.57,29.46 84.07,29.46 88.39,33.78 v95.76,33.78
  Bottom 0.152: v23.62,36.58 21.34,34.29 DISP1.5 | v95.76,33.78 99.06,37.08 109.47,37.08 111.76,34.8 111.76,34.29 DISP4.5
SEGP  (via drill 0.25)
  Top 0.152: DISP5.3 136.91,34.29 134.62,36.58 v109.22,36.58 94.74,36.58 94.23,37.08 91.19,37.08 v89.92,38.35 | R13.2 76.45,33.27 76.45,34.29 DISP3.3 | v35.05,28.45 42.42,28.45 46.23,32.26 46.23,34.29 DISP2.3
  Bottom 0.152: v109.22,36.58 106.93,34.29 DISP4.3 | v35.05,28.45 22.1,28.45 16.26,34.29 DISP1.3 | R13.2 67.31,30.48 65.79,32 48.77,32 46.48,34.29 DISP2.3 | v89.92,38.35 80.52,38.35 76.45,34.29 DISP3.3
URST  (via drill 0.25)
  Top 0.152: v88.39,12.7 88.39,7.62 82.04,1.27 46.99,1.27 29.97,18.29 23.62,18.29 R3.1
  Bottom 0.152: v88.39,12.7 89.41,12.7 IC1.9